# EAGLE schematic IntrepidDashboard (EAGLE 9.6.2)
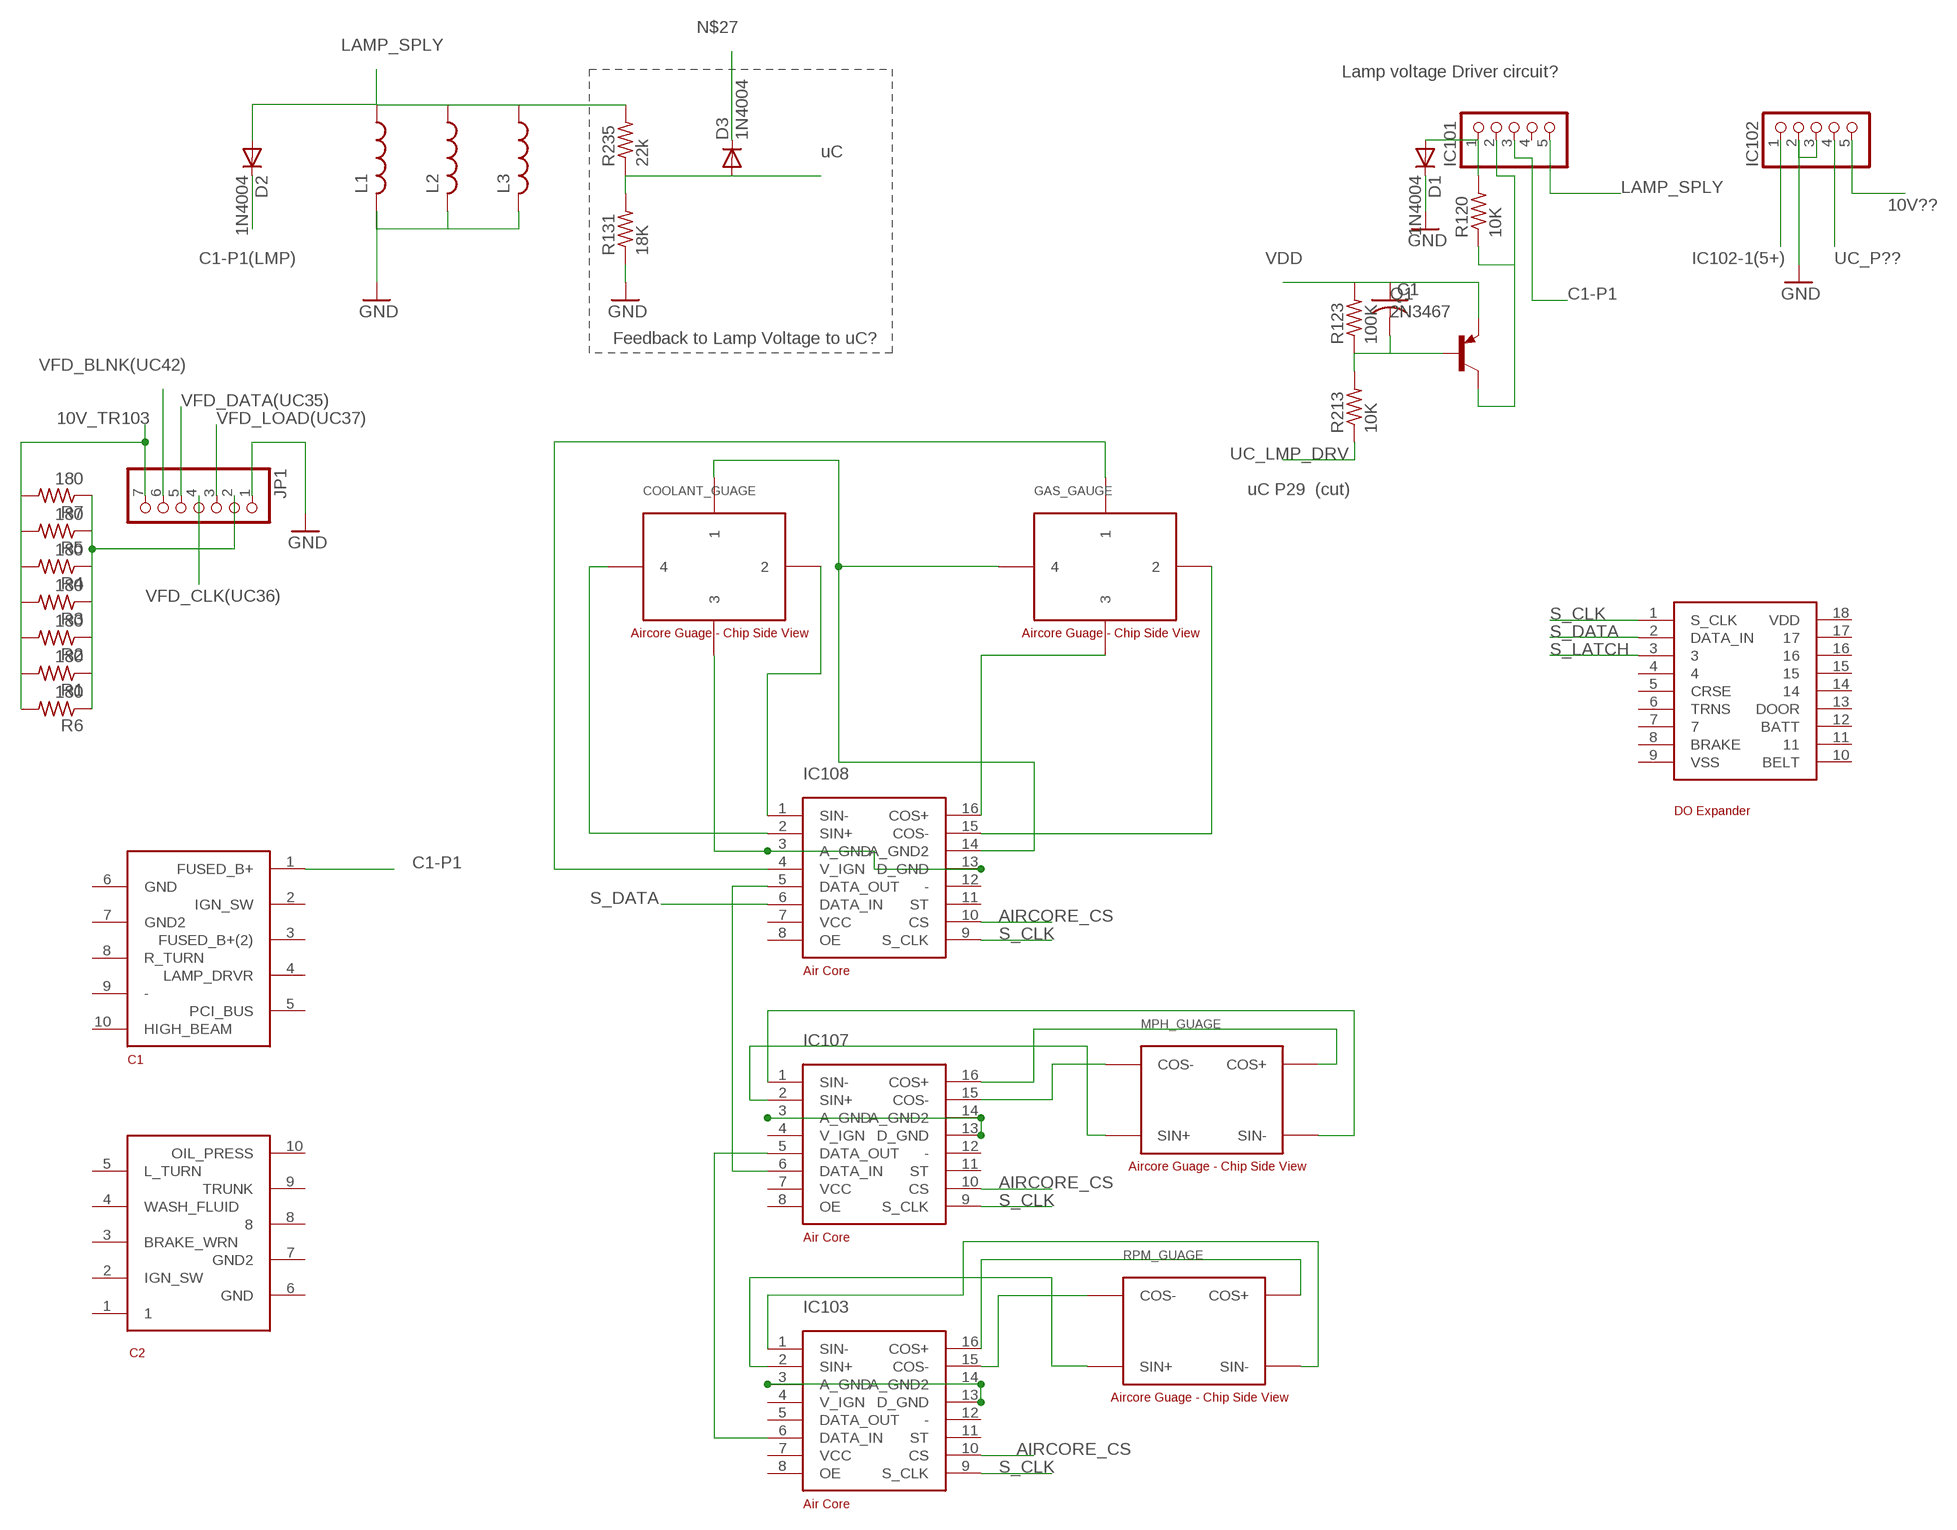
[diagram p0: schematic, sheet 1]

## Parts
C1  C-US025-024X044  [C025-024X044]
COOLANT_GUAGE  AIRCORE_GAUGE1  [AIRCORE1]
D1  1N4004  [DO41-10]
D2  1N4004  [DO41-10]
D3  1N4004  [DO41-10]
GAS_GAUGE  AIRCORE_GAUGE1  [AIRCORE1]
IC101  PINHD-1X5  [1X05]
IC102  PINHD-1X5  [1X05]
IC103  AIR_CORE  [SOIC-16]
IC107  AIR_CORE  [SOIC-16]
IC108  AIR_CORE  [SOIC-16]
JP1  PINHD-1X7  [1X07]
L1  L-US0204/5  [0204/5]
L2  L-US0204/5  [0204/5]
L3  L-US0204/5  [0204/5]
MPH_GUAGE  AIRCORE_GUAGE2  [AIRCORE1]
Q1  2N3467  [TO39]
R1  180  R-US_0204/2V  [0204V]
R2  180  R-US_0204/2V  [0204V]
R3  180  R-US_0204/2V  [0204V]
R4  180  R-US_0204/2V  [0204V]
R5  180  R-US_0204/2V  [0204V]
R6  180  R-US_0204/2V  [0204V]
R7  180  R-US_0204/2V  [0204V]
R120  10K  R-US_0204/2V  [0204V]
R123  100K  R-US_0204/2V  [0204V]
R131  18K  R-US_0204/2V  [0204V]
R213  10K  R-US_0204/2V  [0204V]
R235  22k  R-US_0204/2V  [0204V]
RPM_GUAGE  AIRCORE_GUAGE2  [AIRCORE1]
U$1  DO_EXPANDER  [SOIC-18]
U$2  C1  [UMAX_10]
U$3  C2  [UMAX_10]

## Nets
10V??: IC102.5
10V_TR103: JP1.7 R1.2 R2.2 R3.2 R4.2 R5.2 R6.2 R7.2
AIRCORE_CS: IC103.10(CS) IC107.10(CS) IC108.10(CS)
C1-P1: IC101.3 U$2.1(FUSED_B+)
C1-P1(LMP): D2.C
GND: D1.C IC102.2 IC102.3 JP1.1 L1.2 L2.2 L3.2 R131.1
IC102-1(5+): IC102.1
LAMP_SPLY: D2.A IC101.5 L1.1 L2.1 L3.1 R235.2
N$1: COOLANT_GUAGE.P$4 IC108.2(SIN+)
N$2: COOLANT_GUAGE.P$2 IC108.1(SIN-)
N$3: COOLANT_GUAGE.P$3 IC108.3(A_GND) IC108.13(D_GND)
N$4: COOLANT_GUAGE.P$1 GAS_GAUGE.P$4 IC108.14(A_GND2)
N$5: GAS_GAUGE.P$3 IC108.16(COS+)
N$6: GAS_GAUGE.P$2 IC108.15(COS-)
N$7: GAS_GAUGE.P$1 IC108.4(V_IGN)
N$8: IC107.6(DATA_IN) IC108.5(DATA_OUT)
N$9: IC103.6(DATA_IN) IC107.5(DATA_OUT)
N$10: IC107.2(SIN+) MPH_GUAGE.P$3(SIN+)
N$11: IC107.15(COS-) MPH_GUAGE.P$2(COS-)
N$12: IC107.3(A_GND) IC107.13(D_GND) IC107.14(A_GND2)
N$13: IC107.16(COS+) MPH_GUAGE.P$1(COS+)
N$14: IC107.1(SIN-) MPH_GUAGE.P$4(SIN-)
N$15: IC103.3(A_GND) IC103.13(D_GND) IC103.14(A_GND2)
N$16: IC103.16(COS+) RPM_GUAGE.P$1(COS+)
N$17: IC103.15(COS-) RPM_GUAGE.P$2(COS-)
N$18: IC103.1(SIN-) RPM_GUAGE.P$4(SIN-)
N$19: IC103.2(SIN+) RPM_GUAGE.P$3(SIN+)
N$20: D1.A IC101.1 R120.2
N$21: IC101.2 Q1.3(C) R120.1
N$22: D3.A R131.2 R235.1
N$23: C1.2 Q1.2(B) R123.1 R213.2
N$24: JP1.2 R1.1 R2.1 R3.1 R4.1 R5.1 R6.1 R7.1
N$27: D3.C
S_CLK: IC103.9(S_CLK) IC107.9(S_CLK) IC108.9(S_CLK) U$1.1(S_CLK)
S_DATA: IC108.6(DATA_IN) U$1.2(DATA_IN)
S_LATCH: U$1.3
UC_LMP_DRV: R213.1
UC_P??: IC102.4
VDD: C1.1 Q1.1(E) R123.2
VFD_BLNK(UC42): JP1.6
VFD_CLK(UC36): JP1.4
VFD_DATA(UC35): JP1.5
VFD_LOAD(UC37): JP1.3
Unconnected: IC101.4 IC103.4(V_IGN) IC103.5(DATA_OUT) IC103.7(VCC) IC103.8(OE) IC103.11(ST) IC103.12(-) IC107.4(V_IGN) IC107.7(VCC) IC107.8(OE) IC107.11(ST) IC107.12(-) IC108.7(VCC) IC108.8(OE) IC108.11(ST) IC108.12(-) U$1.4 U$1.5(CRSE) U$1.6(TRNS) U$1.7 U$1.8(BRAKE) U$1.9(VSS) U$1.10(BELT) U$1.11 U$1.12(BATT) U$1.13(DOOR) U$1.14 U$1.15 U$1.16 U$1.17 U$1.18(VDD) U$2.2(IGN_SW) U$2.3(FUSED_B+(2)) U$2.4(LAMP_DRVR) U$2.5(PCI_BUS) U$2.6(GND) U$2.7(GND2) U$2.8(R_TURN) U$2.9(-) U$2.10(HIGH_BEAM) U$3.1 U$3.2(IGN_SW) U$3.3(BRAKE_WRN) U$3.4(WASH_FLUID) U$3.5(L_TURN) U$3.6(GND) U$3.7(GND2) U$3.8 U$3.9(TRUNK) U$3.10(OIL_PRESS)

## Notes on the sheet
- Lamp voltage Driver circuit?
- uC
- Feedback to Lamp Voltage to uC?
- uC P29  (cut)

## Library data of the parts
C1 = resistor:C-US: CAPACITOR, American symbol
COOLANT_GUAGE GAS_GAUGE = IntrepidDashboard:AIRCORE_GAUGE1
D1-D3 = diode:1N4004: DIODE general purpose rectifier, 1 A
IC101 IC102 = pinhead:PINHD-1X5: PIN HEADER
IC103 IC107 IC108 = IntrepidDashboard:AIR_CORE
JP1 = pinhead:PINHD-1X7: PIN HEADER
L1-L3 = rcl:L-US: INDUCTOR, American symbol
MPH_GUAGE RPM_GUAGE = IntrepidDashboard:AIRCORE_GUAGE2
Q1 = transistor-pnp:2N3467*: PNP Transistror
R1-R7 R120 R123 R131 R213 R235 = resistor:R-US_: RESISTOR, American symbol
U$1 = IntrepidDashboard:DO_EXPANDER
U$2 = IntrepidDashboard:C1
U$3 = IntrepidDashboard:C2